# EAGLE design Bordnetzwandler (EAGLE 6.5.0)

## Sheet 1 of 3: Supply
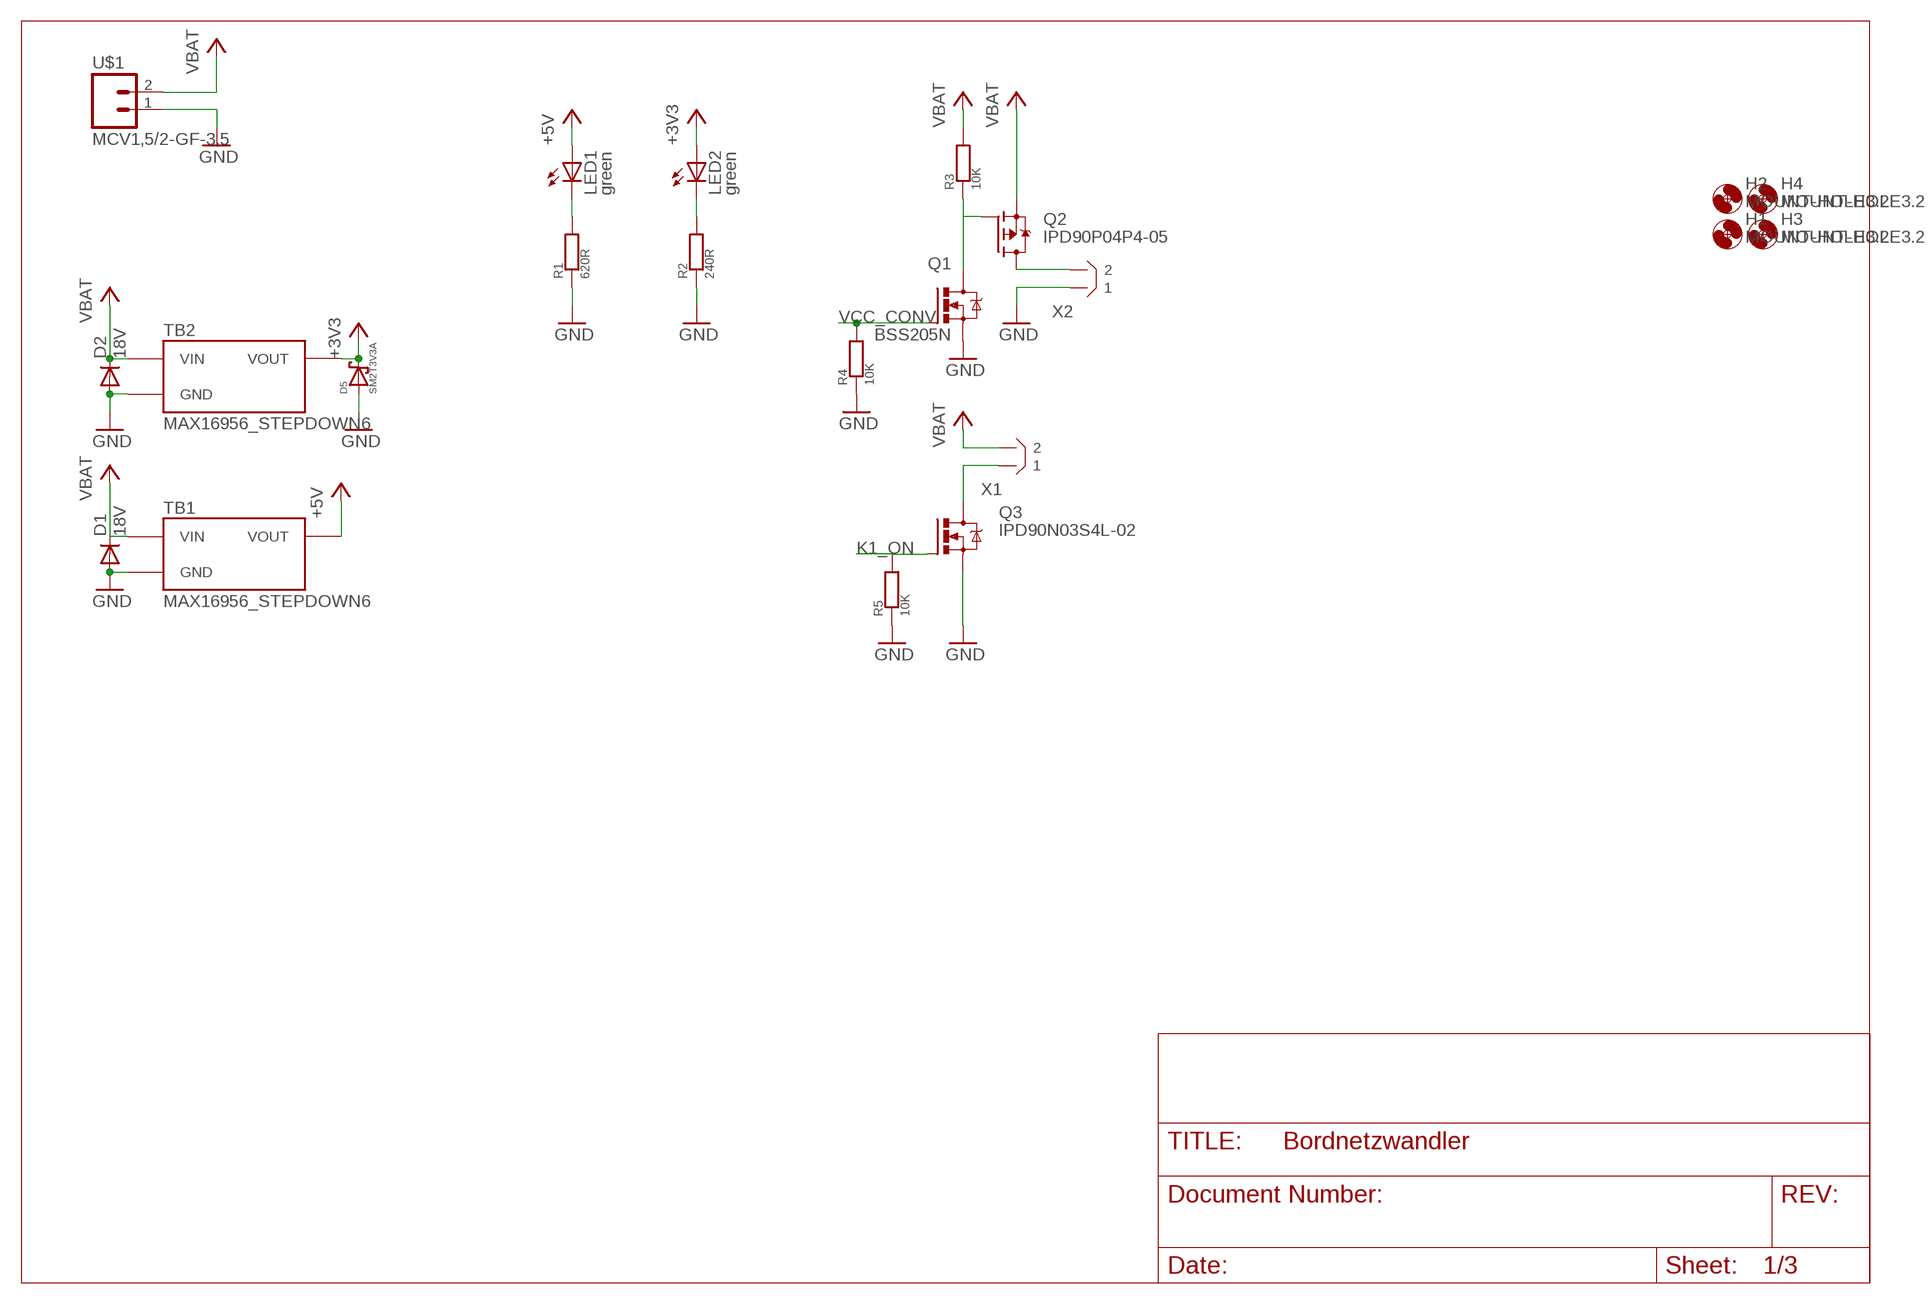
[diagram p0: schematic, sheet 1]

### Parts
D1  18V  DIODE-DO214AA  [DO214AA]
D2  18V  DIODE-DO214AA  [DO214AA]
D5  SM2T3V3A  [SM2T3V3A]
H1  MOUNT-HOLE3.2  [3,2]
H2  MOUNT-HOLE3.2  [3,2]
H3  MOUNT-HOLE3.2  [3,2]
H4  MOUNT-HOLE3.2  [3,2]
LED1  green  LEDCHIP-LED0805  [CHIP-LED0805]
LED2  green  LEDCHIP-LED0805  [CHIP-LED0805]
Q1  BSS205N  [SOT23]
Q2  IPD90P04P4-05  [TO252]
Q3  IPD90N03S4L-02  [TO252]
R1  620R  R  [R0805]
R2  240R  R  [R0805]
R3  10K  R  [R0805]
R4  10K  R  [R0805]
R5  10K  R  [R0805]
TB1  MAX16956_STEPDOWN6  [MAX16956_STEPDOWN6]
TB2  MAX16956_STEPDOWN6  [MAX16956_STEPDOWN6]
U$1  MCV1,5/2-GF-3,5  [MCV1,5/2-GF-3,5]
X1  B2B-XH  [B2B-XH]
X2  B2B-XH  [B2B-XH]

### Nets
+3V3: D5.P$2 LED2.A TB2.VOUT ; also sheet 2
+5V: LED1.A TB1.VOUT ; also sheet 2,3
GND: D1.A D2.A D5.P$1 D5.P$11 Q1.2(S) Q3.3(S) R1.1 R2.1 R4.1 R5.1 TB1.GND TB1.GND2(GND) TB2.GND TB2.GND2(GND) U$1.1 X2.P$1 ; also sheet 2,3
K1_ON: Q3.1(G) R5.2 ; also sheet 2
N$1: LED1.C R1.2
N$2: LED2.C R2.2
N$3: Q1.3(D) Q2.1(G) R3.1
N$6: Q2.2(D) X2.P$2
N$10: Q3.2(D) X1.P$1
VBAT: D1.C D2.C Q2.3(S) R3.2 TB1.VIN TB2.VIN U$1.2 X1.P$2 ; also sheet 2,3
VCC_CONV: Q1.1(G) R4.2 ; also sheet 2

## Sheet 2 of 3: Prozessor
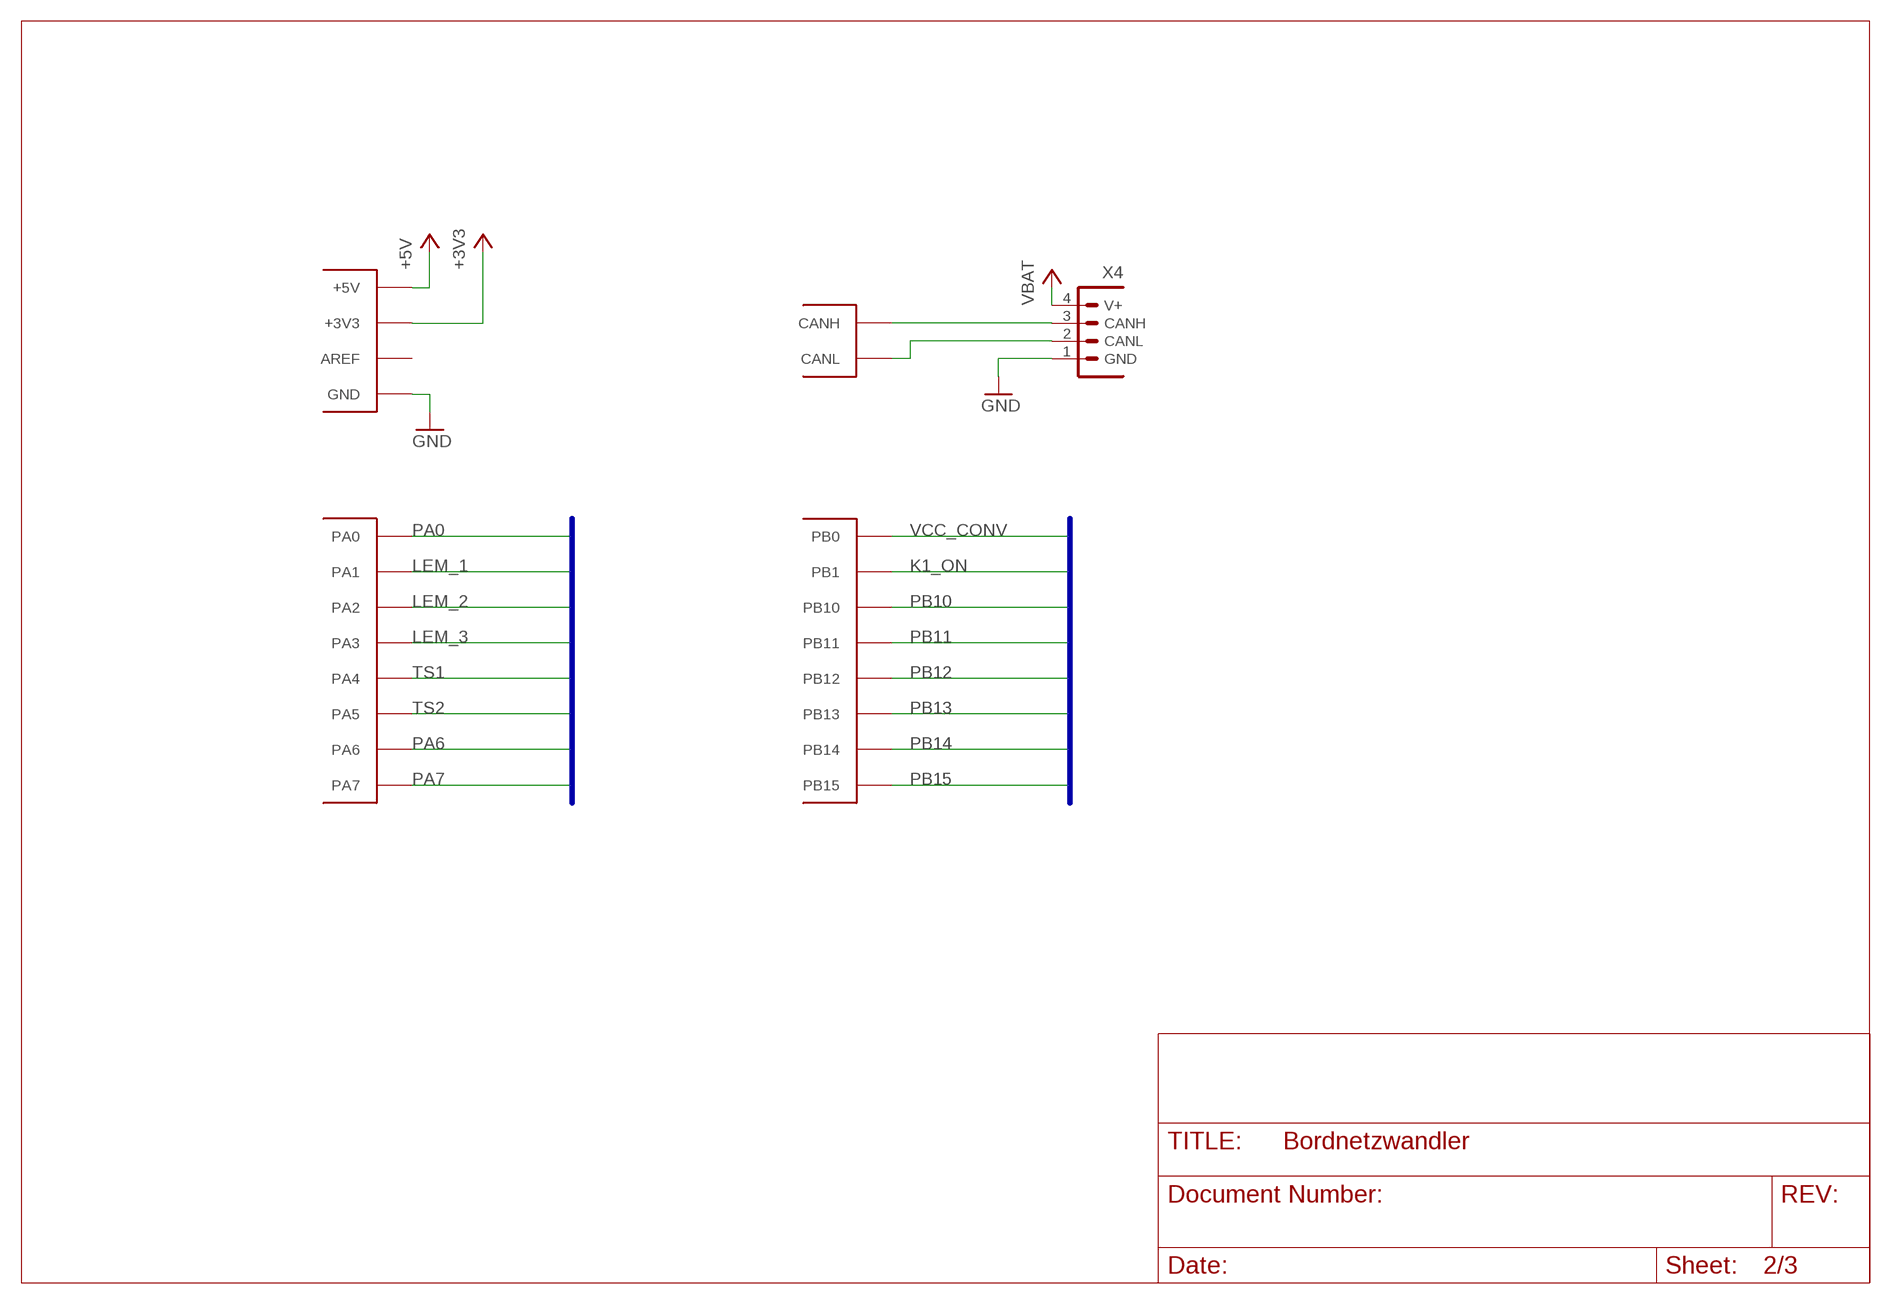
[diagram p1: schematic, sheet 2]

### Parts
CANIO_1  STM32F103XX_CAN-IO-EXPANDER  [STM32F103XX_CANIO-EXPANDER]
X4  CIOC_4-1-FV-A_CAN-BELEGUNG  [CIOC_4-1-FV]

### Nets
+3V3: CANIO_1.VCC(+3V3) ; also sheet 1
+5V: CANIO_1.+5V ; also sheet 1,3
CAN1_H: CANIO_1.CANH X4.3(CANH)
CAN1_L: CANIO_1.CANL X4.2(CANL)
GND: CANIO_1.GND1(GND) X4.1(GND) ; also sheet 1,3
K1_ON: CANIO_1.PB1 ; also sheet 1
LEM_1: CANIO_1.PA1 ; also sheet 3
LEM_2: CANIO_1.PA2 ; also sheet 3
LEM_3: CANIO_1.PA3 ; also sheet 3
PA0: CANIO_1.PA0
PA6: CANIO_1.PA6
PA7: CANIO_1.PA7
PB10: CANIO_1.PB10
PB11: CANIO_1.PB11
PB12: CANIO_1.PB12
PB13: CANIO_1.PB13
PB14: CANIO_1.PB14
PB15: CANIO_1.PB15
TS1: CANIO_1.PA4 ; also sheet 3
TS2: CANIO_1.PA5 ; also sheet 3
VBAT: X4.4(V+) ; also sheet 1,3
VCC_CONV: CANIO_1.PB0 ; also sheet 1
Unconnected: CANIO_1.AREF

### Buses
PA[0..7]
PB[10..15],PB[0..1]

## Sheet 3 of 3: IO
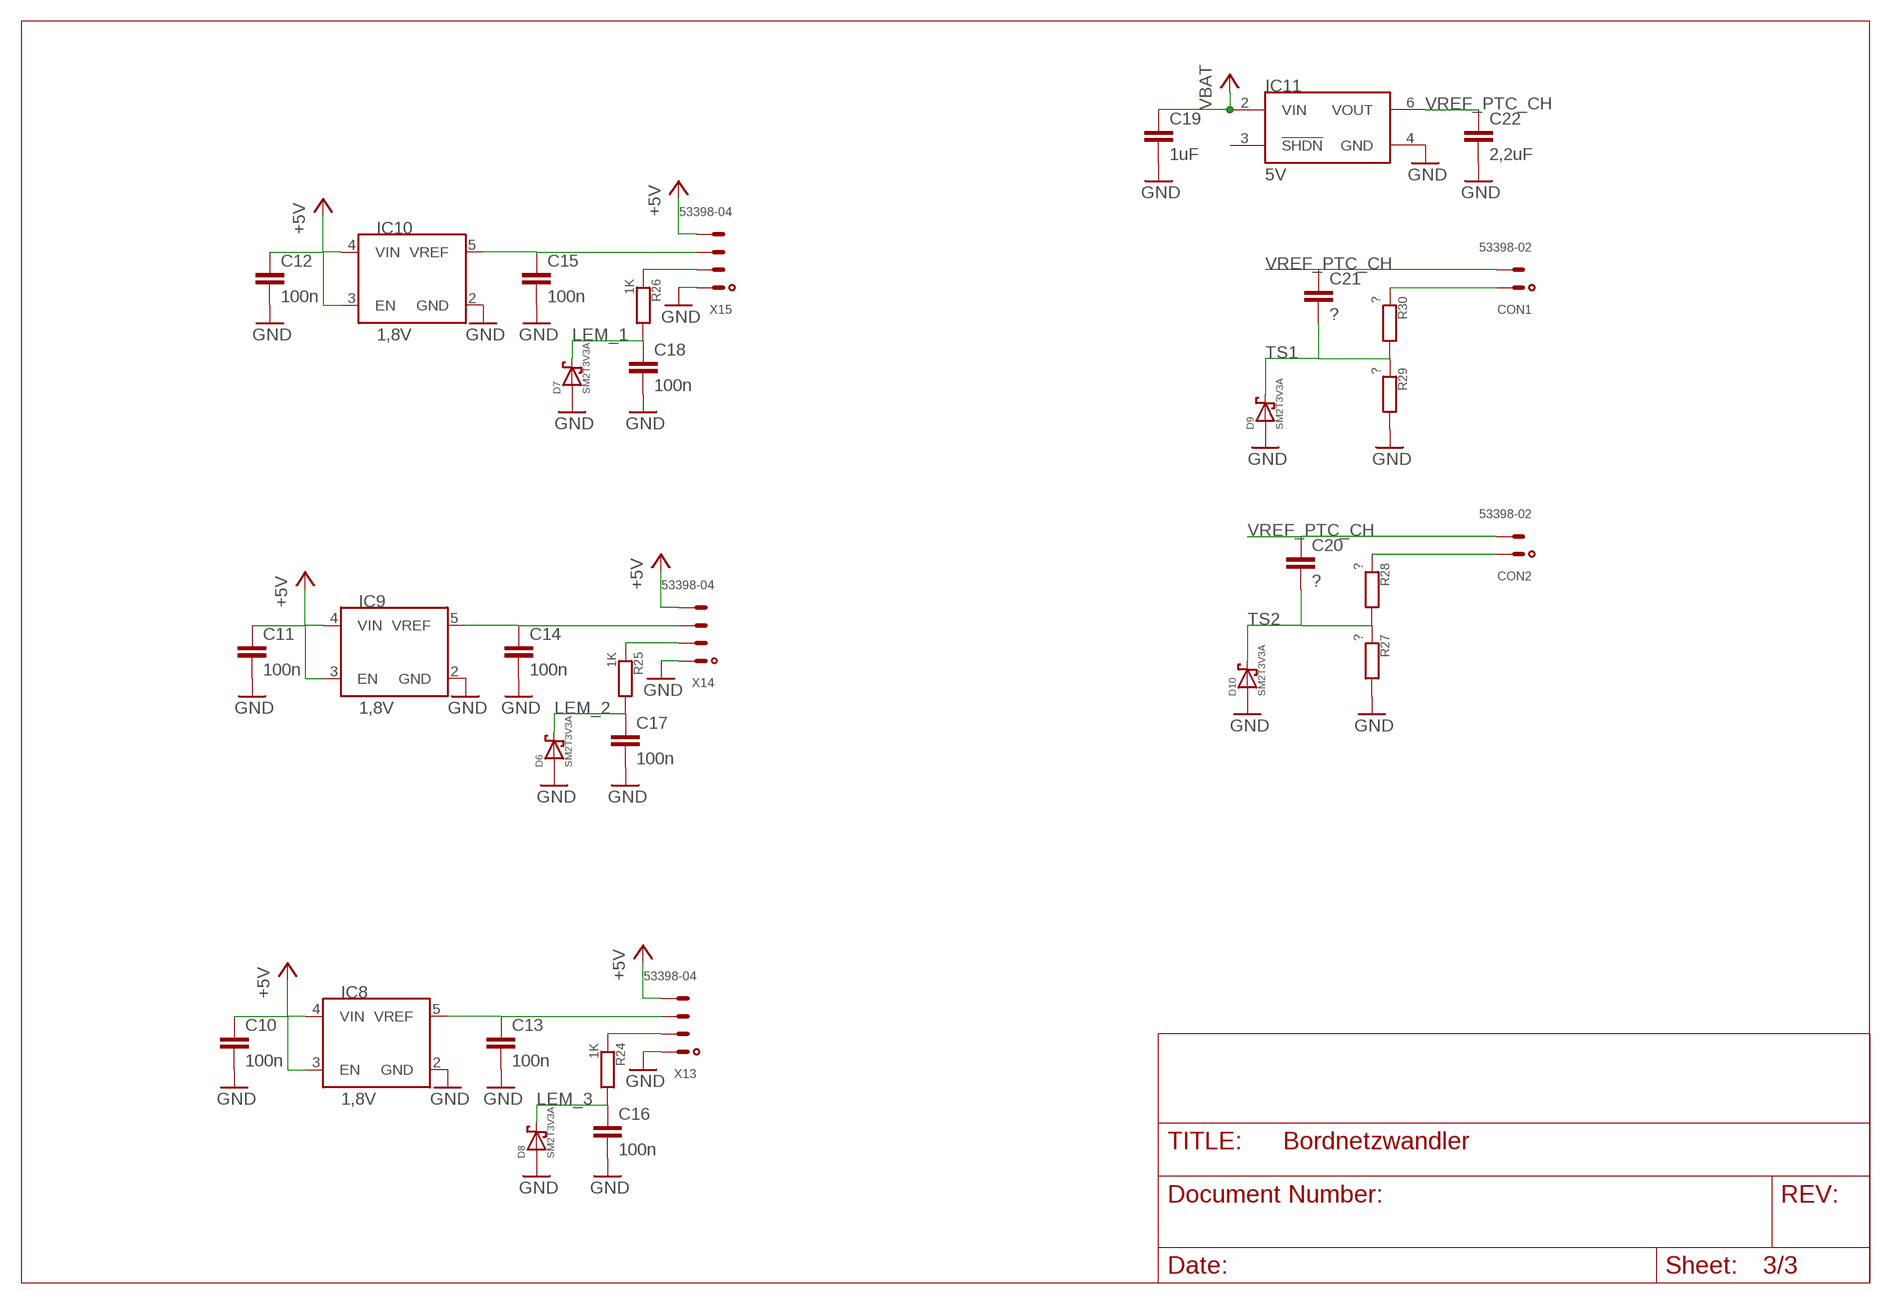
[diagram p2: schematic, sheet 3]

### Parts
C10  100n  C-EUC0805  [C0805]
C11  100n  C-EUC0805  [C0805]
C12  100n  C-EUC0805  [C0805]
C13  100n  C-EUC0805  [C0805]
C14  100n  C-EUC0805  [C0805]
C15  100n  C-EUC0805  [C0805]
C16  100n  C-EUC0805  [C0805]
C17  100n  C-EUC0805  [C0805]
C18  100n  C-EUC0805  [C0805]
C19  1uF  C-EUC0805  [C0805]
C20  ?  C-EUC0805  [C0805]
C21  ?  C-EUC0805  [C0805]
C22  2,2uF  C-EUC0805  [C0805]
CON1  53398-02  [53398-02]
CON2  53398-02  [53398-02]
D6  SM2T3V3A  [SM2T3V3A]
D7  SM2T3V3A  [SM2T3V3A]
D8  SM2T3V3A  [SM2T3V3A]
D9  SM2T3V3A  [SM2T3V3A]
D10  SM2T3V3A  [SM2T3V3A]
IC8  1,8V  LM4132L  [SOT23-5L]
IC9  1,8V  LM4132L  [SOT23-5L]
IC10  1,8V  LM4132L  [SOT23-5L]
IC11  5V  LT1461  [SO08]
R24  1K  R  [R0805]
R25  1K  R  [R0805]
R26  1K  R  [R0805]
R27  ?  R  [R0805]
R28  ?  R  [R0805]
R29  ?  R  [R0805]
R30  ?  R  [R0805]
X13  53398-04  [53398-04]
X14  53398-04  [53398-04]
X15  53398-04  [53398-04]

### Nets
+5V: C10.1 C11.1 C12.1 IC8.3(EN) IC8.4(VIN) IC9.3(EN) IC9.4(VIN) IC10.3(EN) IC10.4(VIN) X13.4 X14.4 X15.4 ; also sheet 1,2
GND: C10.2 C11.2 C12.2 C13.2 C14.2 C15.2 C16.2 C17.2 C18.2 C19.2 C22.2 D6.P$1 D6.P$11 D7.P$1 D7.P$11 D8.P$1 D8.P$11 D9.P$1 D9.P$11 D10.P$1 D10.P$11 IC8.2(GND) IC9.2(GND) IC10.2(GND) IC11.4(GND) R27.2 R29.2 X13.1 X14.1 X15.1 ; also sheet 1,2
LEM_1: C18.1 D7.P$2 R26.2 ; also sheet 2
LEM_2: C17.1 D6.P$2 R25.2 ; also sheet 2
LEM_3: C16.1 D8.P$2 R24.2 ; also sheet 2
N$4: C13.1 IC8.5(VREF) X13.3
N$7: R26.1 X15.2
N$9: C14.1 IC9.5(VREF) X14.3
N$25: CON1.1 R30.1
N$31: R25.1 X14.2
N$32: C15.1 IC10.5(VREF) X15.3
N$33: R24.1 X13.2
N$35: CON2.1 R28.1
TS1: C21.2 D9.P$2 R29.1 R30.2 ; also sheet 2
TS2: C20.2 D10.P$2 R27.1 R28.2 ; also sheet 2
VBAT: C19.1 IC11.2(VIN) ; also sheet 1,2
VREF_PTC_CH: C20.1 C21.1 C22.1 CON1.2 CON2.2 IC11.6(VOUT)
Unconnected: IC11.3(!SHDN)

## Library data of the parts
C10-C22 = rcl:C-EU: CAPACITOR, European symbol
CANIO_1 = tera-boards:STM32F103XX_CAN-IO-EXPANDER: Tera CAN-IO Expander Board
CON1 CON2 = con-molex:53?-02: CONNECTOR wire to board 1.25 mm (.049 inch) pitch header
D1 D2 = diode:DIODE-: DIODE
D5-D10 = st:SM2T3V3A: ST2T3V3A Low voltage TransilTM
H1-H4 = holes:MOUNT-HOLE: MOUNTING HOLE with drill center marker
IC8-IC10 = ti:LM4132
IC11 = linear:LT1461
LED1 LED2 = led:LED: LED OSRAM: - CHIPLED LG R971, LG N971, LY N971, LG Q971, LY Q971, LO R971, LY R971 LH N974, LH R974 LS Q976, LO Q976, LY Q976 LO Q996 - Hyper CHIPLED LW Q18S LB Q993, LB Q99A, LB R99A - SideLED LS A670, LO A670, LY A670, LG A670, LP A670 LB A673, LV A673, LT A673, LW A673 LH A674 LY A675 LS A676, LA A676, LO A676, LY A676, LW A676 LS A679, LY A679, LG A679 - Hyper Micro SIDELED® LS Y876, LA Y876, LO Y876, LY Y876 LT Y87S - SmartLED LW L88C, LW L88S LB L89C, LB L89S, LG L890 LS L89K, LO L89K, LY L89K LS L896, LA L896, LO L896, LY L896 - TOPLED LS T670, LO T670, LY T670, LG T670, LP T670 LSG T670, LSP T670, LSY T670, LOP T670, LYG T670 LG T671, LOG T671, LSG T671 LB T673, LV T673, LT T673, LW T673 LH T674 LS T676, LA T676, LO T676, LY T676, LB T676, LH T676, LSB T676, LW T676 LB T67C, LV T67C, LT T67C, LS T67K, LO T67K, LY T67K, LW E67C LS E67B, LA E67B, LO E67B, LY E67B, LB E67C, LV E67C, LT E67C LW T67C LS T679, LY T679, LG T679 LS T770, LO T770, LY T770, LG T770, LP T770 LB T773, LV T773, LT T773, LW T773 LH T774 LS E675, LA E675, LY E675, LS T675 LS T776, LA T776, LO T776, LY T776, LB T776 LHGB T686 LT T68C, LB T68C - Hyper Mini TOPLED® LB M676 - Mini TOPLED Santana® LG M470 LS M47K, LO M47K, LY M47K Source: http://www.osram.convergy.de LUXEON: - LUMILED® LXK2-PW12-R00, LXK2-PW12-S00, LXK2-PW14-U00, LXK2-PW14-V00 LXK2-PM12-R00, LXK2-PM12-S00, LXK2-PM14-U00 LXK2-PE12-Q00, LXK2-PE12-R00, LXK2-PE12-S00, LXK2-PE14-T00, LXK2-PE14-U00 LXK2-PB12-K00, LXK2-PB12-L00, LXK2-PB12-M00, LXK2-PB14-N00, LXK2-PB14-P00, LXK2-PB14-Q00 LXK2-PR12-L00, LXK2-PR12-M00, LXK2-PR14-Q00, LXK2-PR14-R00 LXK2-PD12-Q00, LXK2-PD12-R00, LXK2-PD12-S00 LXK2-PH12-R00, LXK2-PH12-S00 LXK2-PL12-P00, LXK2-PL12-Q00, LXK2-PL12-R00 Source: www.luxeon.com KINGBRIGHT: KA-3528ASYC Source: www.kingbright.com
Q1 = infineon:BSS205N: Infineon Small Signal Transistor, OptiMOS 2 Technology, 20V, 2.5A SOT23
Q2 = infineon:IPD90P04P4-05: Infineon P-Channel Mosfet for automotive puproses. IDmax=-90A V_DSmax=-40V
Q3 = infineon:IPD90N03S4L-02: Automotive Power Mosfet with CMOS Logic Level an very low Ron
R1-R5 R24-R30 = useful:R
TB1 TB2 = tera-boards:MAX16956_STEPDOWN6
U$1 = con-phoenix:MCV1,5/2-GF-3,5
X1 X2 = con-jst-xh:?2B-XH
X4 = con-phoenix:CIOC_4-1-FV-A_CAN-BELEGUNG: CIOC_4-1-FV-A mit Bezeichnungen für CAN-Signale und Versorgungen; MANUF: Phoenix-Contact; ORDERNR: 1701388
X13-X15 = con-molex:53?-04: CONNECTOR wire to board 1.25 mm (.049 inch) pitch header

## Board
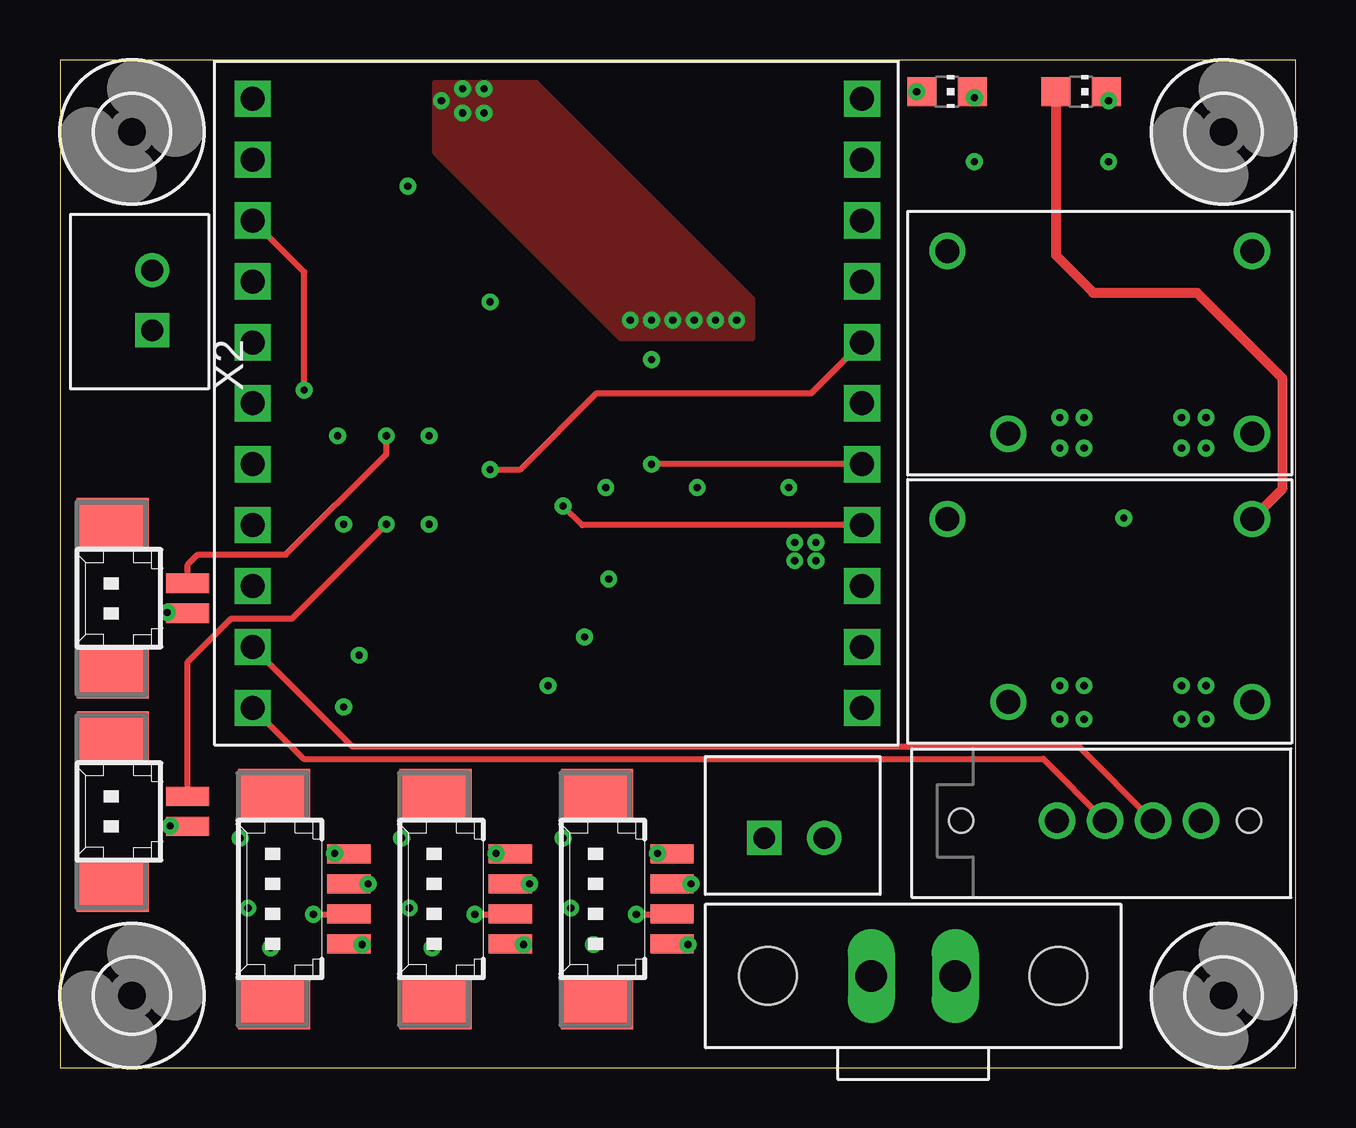
[diagram p3: board, top side]
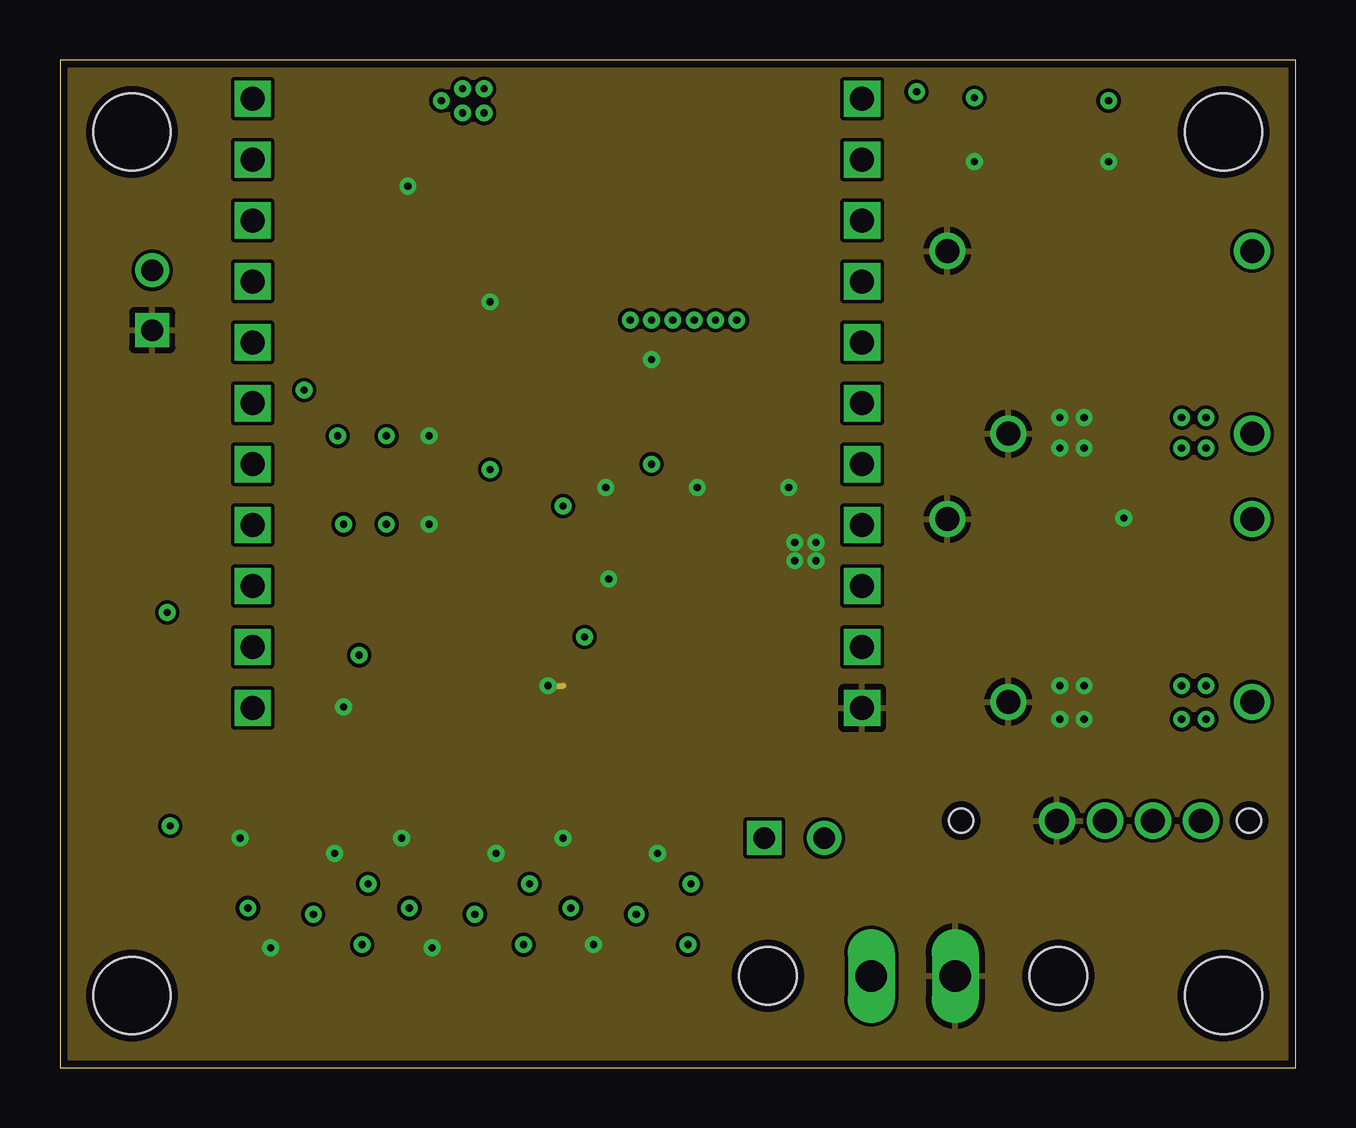
[diagram p4: board, inner layer Route2]
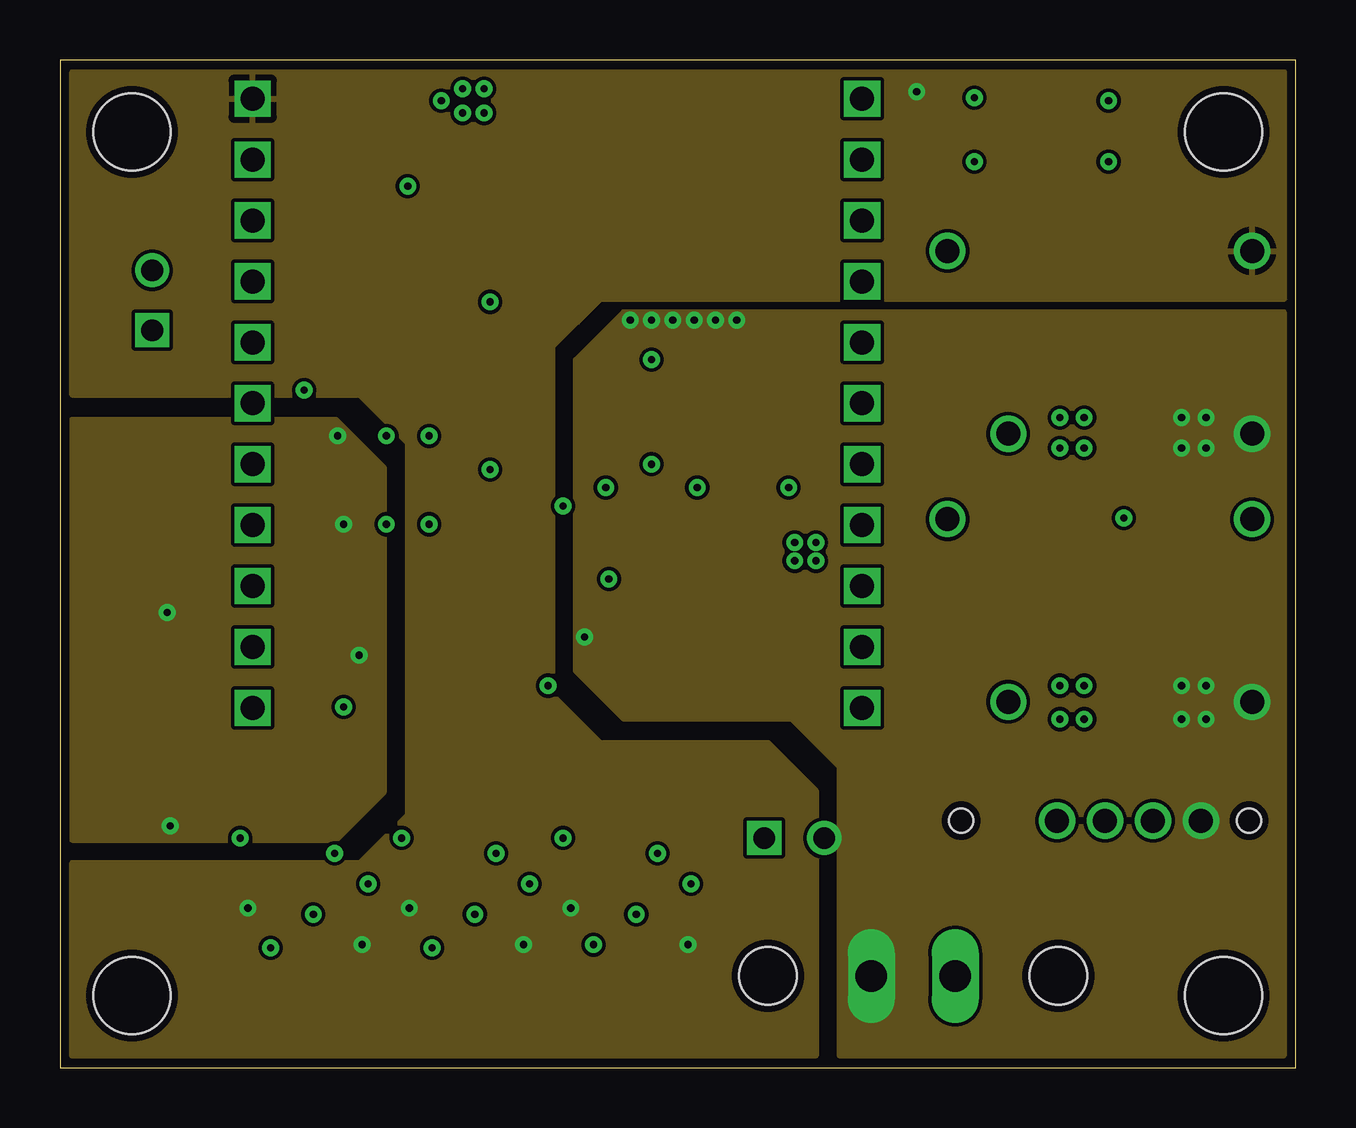
[diagram p5: board, inner layer Route15]
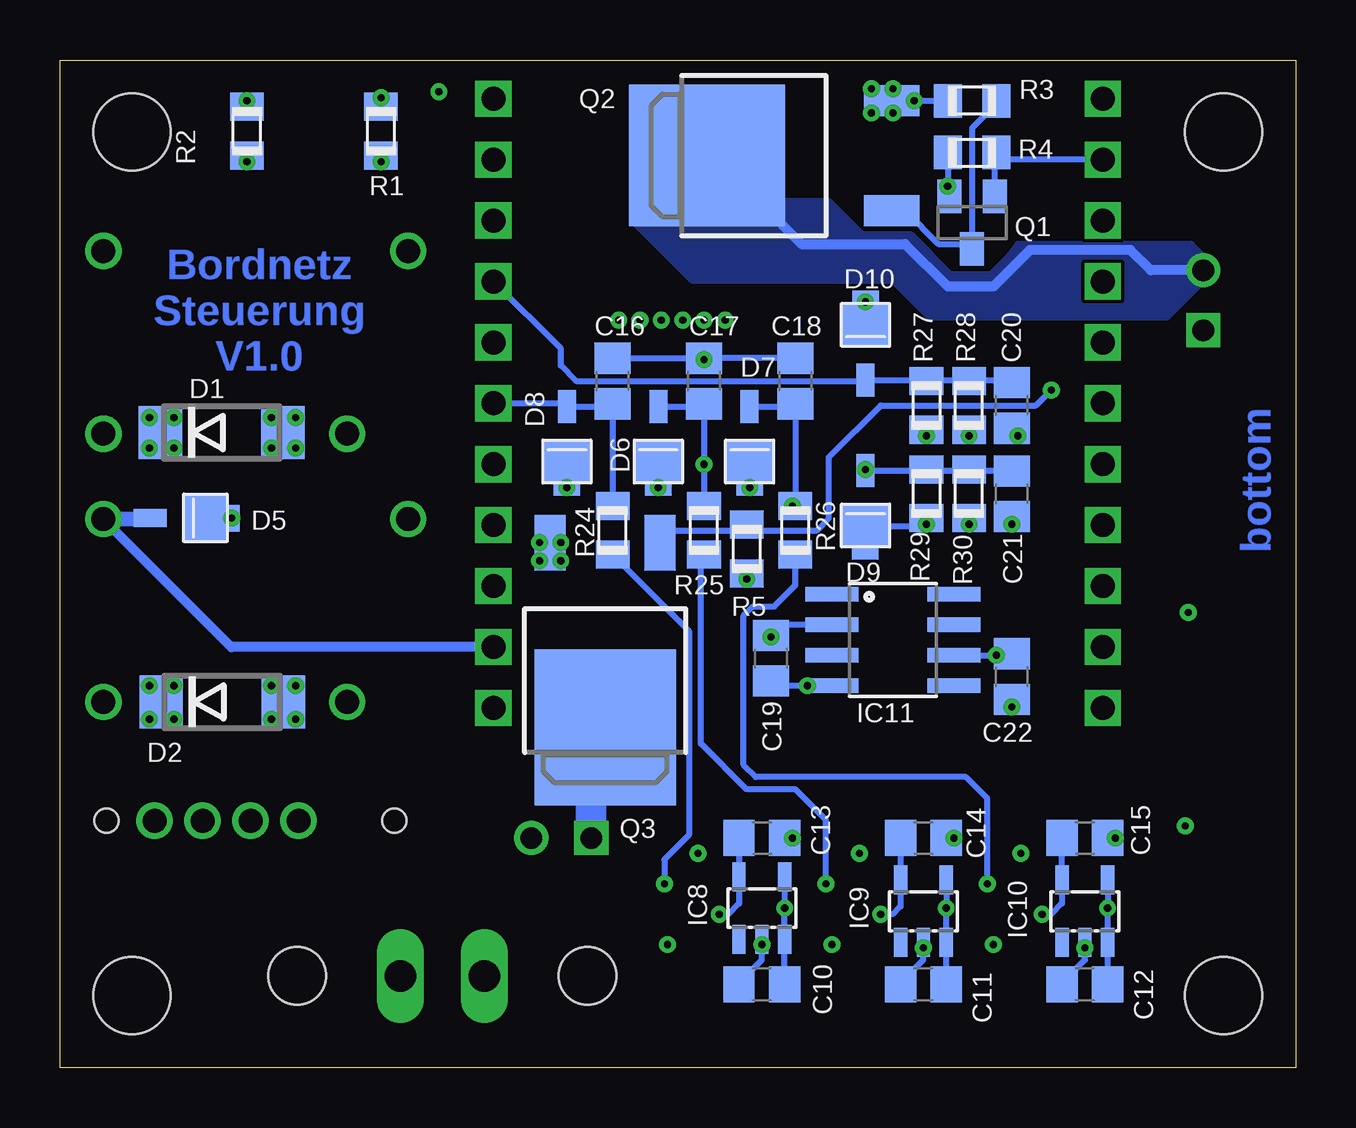
[diagram p6: board, bottom side, seen from below]

Size 51.5 x 42 mm. Coordinates in mm from the lower left corner, seen from the top.
Outline: 0,0 51.5,0 51.5,42 0,42 0,0
Copper layers (1+2*15+16): Top 0.035mm / dielectric 0.2mm / Route2 0.035mm / dielectric 0.5mm / Route15 0.035mm / dielectric 0.2mm / Bottom 0.035mm
Design rules "ats_35u_4layer *": minimum track width 6mil, minimum drill 0.2mm, track to track 6mil, track to pad 6mil, pad to pad 6mil, via to via 6mil, smd to smd 6mil, copper to edge 0.3mm, drill to drill 8mil, minimum pad ring 10mil, minimum via ring 0.2mm, stop-mask expansion 4mil, vias tented up to drill 0mil, thermal gap 10mil

### Footprints (pad centres in the part's own frame; a part is rotated, then mirrored left to right if it is on the bottom)
C0805 = smd 1.3 x 1.5: 1 -0.95,0; 2 0.95,0
STM32F103XX_CANIO-EXPANDER = drill 1 square: +5V 0,0; AREF 25.4,0; CANH 0,-22.86; CANL 0,-25.4; GND1 25.4,-25.4; PA0 25.4,-20.32; PA1 25.4,-17.78; PA2 25.4,-15.24; PA3 25.4,-12.7; PA4 25.4,-10.16; PA5 25.4,-7.62; PA6 25.4,-5.08; PA7 25.4,-2.54; PB0 0,-2.54; PB1 0,-5.08; PB10 0,-7.62; PB11 0,-10.16; PB12 0,-12.7; PB13 0,-15.24; PB14 0,-17.78; PB15 0,-20.32; VCC 25.4,-22.86
53398-02 = smd 0.8 x 1.8: 1 0.625,-2.5; 2 -0.625,-2.5 | smd 2.1 x 3: S1 3.125,0.625; S2 -3.125,0.625
DO214AA = smd 1.8 x 2.2: A 2.55,0; C -2.55,0
SM2T3V3A = smd 1.82 x 2.03: P$1 -1.21,0 | smd 1.38 x 0.75: P$2 1.1,0 | smd 0.5 x 1.1: P$11 -2.37,0.005
3,2 = hole 3.2: 0,0
SOT23-5L = smd 0.55 x 1.2: 1 -0.95,-1.3; 2 0,-1.3; 3 0.95,-1.3; 4 0.95,1.3; 5 -0.95,1.3
SO08 = smd 0.61 x 2.21: 1 -1.905,-2.54; 2 -0.635,-2.54; 3 0.635,-2.54; 4 1.905,-2.54; 5 1.905,2.54; 6 0.635,2.54; 7 -0.635,2.54; 8 -1.905,2.54
CHIP-LED0805 = smd 1.2 x 1.2: A 0,-1.05; C 0,1.05
SOT23 = smd 1 x 1.4: 1 -0.95,-1.1; 2 0.95,-1.1; 3 0,1.1
TO252 = smd 1.3 x 2.3: 1 -2.29,-4.9; 3 2.29,-4.9 | smd 5.9 x 6.5: 2 0,2.8
R0805 = smd 1.168 x 1.397: 1 -1.016,0; 2 1.016,0
MAX16956_STEPDOWN6 = drill 1: GND 14.351,1.651; GND2 11.811,9.271; VIN 1.651,9.271; VOUT 1.651,1.651
MCV1,5/2-GF-3,5 = drill 1.3 long: 1 0,3.5; 2 0,0 | hole 2.4: 0,7.8; 0,-4.3
B2B-XH = drill 0.9 pad 1.422 square: P$1 0,0 | drill 0.9 pad 1.422: P$2 2.5,0
CIOC_4-1-FV = drill 1: 1 0,0; 2 2,0; 3 4,0; 4 6,0 | hole 1: 8,0; -4,0
53398-04 = smd 0.8 x 1.8: 1 1.875,-2.5; 2 0.625,-2.5; 3 -0.625,-2.5; 4 -1.875,-2.5 | smd 2.1 x 3: S1 4.375,0.625; S2 -4.375,0.625

### Placement (x,y rotation side)
C10  22.24,3.47 180 bottom
C11  15.51,3.47 180 bottom
C12  8.78,3.47 180 bottom
C13  22.24,9.57 0 bottom
C14  15.51,9.57 0 bottom
C15  8.78,9.57 0 bottom
C16  28.47,28.62 90 bottom
C17  24.66,28.62 90 bottom
C18  20.85,28.62 90 bottom
C19  21.86,17.06 270 bottom
C20  11.83,27.6 90 bottom
C21  11.83,23.92 90 bottom
C22  11.83,16.3 270 bottom
CANIO_1  8.03,40.39 0 top
CON1  2.83,10.67 90 top
CON2  2.83,19.56 90 top
D1  44.76,26.47 0 bottom
D2  44.74,15.24 0 bottom
D5  46.63,22.91 180 bottom
D6  26.56,26.46 90 bottom
D7  22.75,26.46 90 bottom
D8  30.37,26.46 90 bottom
D9  17.93,23.79 90 bottom
D10  17.93,29.76 270 bottom
H1  48.5,3 0 top
H2  3,3 0 top
H3  48.5,39 0 top
H4  3,39 0 top
IC8  22.24,6.65 0 bottom
IC9  15.51,6.52 0 bottom
IC10  8.78,6.52 0 bottom
IC11  16.78,17.82 270 bottom
LED1  36.98,40.68 270 top
LED2  42.56,40.68 270 top
Q1  13.48,35.22 180 bottom
Q2  21.73,38.01 90 bottom
Q3  28.78,16.97 180 bottom
R1  38.12,39.03 90 bottom
R2  43.71,39.03 90 bottom
R3  13.48,40.3 180 bottom
R4  13.48,38.14 0 bottom
R5  22.87,21.62 90 bottom
R24  28.47,22.39 90 bottom
R25  24.66,22.39 90 bottom
R26  20.85,22.39 90 bottom
R27  15.39,27.6 270 bottom
R28  13.61,27.6 90 bottom
R29  15.39,23.92 270 bottom
R30  13.61,23.92 90 bottom
TB1  51.34,35.69 180 top
TB2  51.34,24.51 180 top
U$1  33.81,3.81 270 top
X1  29.36,9.57 0 top
X2  3.84,30.74 90 top
X4  41.56,10.29 0 top
X13  23,7.03 90 top
X14  16.27,7.03 90 top
X15  9.54,7.03 90 top

### Tracks (layer width: path | path; a pad name or v marks a point on that pad's centre or on a via)
+3V3
  Top 0.406: LED2.A 41.51,33.86 43.07,32.3 47.39,32.3 50.95,28.74 50.95,24.12 TB2.VOUT
  Bottom 0.406: CANIO_1.VCC 44.36,17.53 TB2.VOUT
  Bottom 0.61: TB2.VOUT 47.82,22.86 D5.P$2
+5V  (via drill 0.3)
  Top 0.254: X15.4 12.43,5.15 v12.59,5.12 | X14.4 19.29,5.15 v19.32,5.12 | X13.4 25.83,5.15 v26.18,5.12 | LED1.A 35.92,40.71 35.83,40.68 v35.7,40.68
  Bottom 0.254: C12.1 IC10.3 v7.83,6.65 IC10.4 | C11.1 IC9.3 v14.56,6.65 IC9.4 | C10.1 IC8.3 v21.29,6.65 IC8.4
  pour Route15: 31.5,0.5 0.5,0.5 0.52,8.54 12.52,8.54 14.52,10.54 14.52,26.04 12.52,28.04 0.52,28.04 0.52,41.5 51.02,41.5 51.02,32.04 22.52,32.04 20.52,30.04 20.52,15.54 22.52,13.54 29.5,13.54 31.5,11.54
CAN1_H
  Top 0.254: CANIO_1.CANH 12.19,13.38 42.48,13.38 X4.3
CAN1_L
  Top 0.254: CANIO_1.CANL 10.16,12.87 40.98,12.87 X4.2
GND  (via drill 0.3)
  Top 0.254: X15.1 11.66,8.89 v11.45,8.93 | X14.1 19.28,8.89 v18.18,8.93 | X13.1 25.38,8.97 v24.91,8.93
  Route2 0.254: v20.34,15.92 20.97,15.92 | v11.83,15.03 11.83,14.9
  Bottom 0.254: D7.P$1 22.75,24.22 D7.P$11 v22.76,24.18 v22.75,24.17 | v26.56,24.17 v26.57,24.18 D6.P$11 26.56,24.22 D6.P$1 | D8.P$1 30.37,24.22 D8.P$11 v30.38,24.18 v30.37,24.17 | C16.2 C17.2 | C17.2 v24.66,29.5 | C18.2 C17.2 | C19.2 21.67,15.92 v20.34,15.92 IC11.4 | C22.2 v11.83,15.03 | R27.2 v15.39,26.33 | R29.2 v15.39,22.65 15.45,22.58 D9.P$1 D9.P$11 | R4.1 v14.5,36.74 14.5,36.39 Q1.2 | v17.93,31.92 17.92,32.04 D10.P$11 v17.93,31.92 | D10.P$1 v17.93,31.92 | C15.2 v7.51,9.57 | C14.2 v14.24,9.57 | C13.2 v20.97,9.57 | C12.2 9.73,3.54 8.78,4.49 v8.78,4.99 | IC10.2 v8.78,4.99 | 8.78,4.61 v8.78,4.99 | C11.2 16.4,3.47 16.4,3.6 15.51,4.49 v15.51,4.99 IC9.2 | IC8.2 v22.24,5.12 22.24,4.49 23.19,3.54 C10.2 | D5.P$1 D5.P$11 v44.34,22.9 | D1.A 42.21,26.61 v42.69,27.09 | D2.A 42.19,15.41 v42.69,15.92 | R2.1 v43.71,37.76 | R1.1 v38.12,37.76 | R5.1 v22.88,20.36 | Q3.3 31.01,21.81 v30.62,21.12
  other vias: 41.67,27.09 41.67,25.82 42.69,25.82 41.67,15.92 42.69,14.52 41.67,14.52 30.62,21.89 31.51,21.89 31.51,21.12
  pour Route2: -5.38,-3.98 -3.22,44.5 55.74,45.65 53.33,-2.97
K1_ON  (via drill 0.3)
  Top 0.254: v10.18,28.23 10.18,33.16 CANIO_1.PB1
  Bottom 0.254: Q3.1 26.18,22.18 26.18,22.27 26.31,22.39 23.39,22.39 23.15,22.63 R5.2 22.61,22.63 22.37,22.39 19.96,22.39 19.45,22.9 19.45,25.44 17.29,27.6 10.81,27.6 v10.18,28.23
LEM_1  (via drill 0.3)
  Top 0.254: CANIO_1.PA1 21.77,22.61 v20.97,23.41
  Bottom 0.254: 20.85,27.68 C18.1 | C18.1 R26.2 v20.97,23.41 | D7.P$2 20.96,27.56 C18.1
LEM_2  (via drill 0.3)
  Top 0.254: CANIO_1.PA2 v24.66,25.15
  Bottom 0.254: 24.66,27.68 C17.1 | C17.1 v24.66,25.15 R25.2 | D6.P$2 24.77,27.56 C17.1
LEM_3
  Bottom 0.254: 28.47,27.68 C16.1 | CANIO_1.PA3 30.37,27.69 D8.P$2 28.57,27.56 C16.1 | C16.1 R24.2
N$1  (via drill 0.3)
  Top 0.254: LED1.C v38.12,40.43
  Bottom 0.254: v38.12,40.43 R1.2
N$2  (via drill 0.3)
  Top 0.254: LED2.C v43.71,40.3
  Bottom 0.254: v43.71,40.3 R2.2
N$3
  Bottom 0.254: Q2.1 16.27,35.72 14.88,34.33 13.69,34.33 Q1.3 13.48,39.16 12.46,40.17 R3.1
N$4  (via drill 0.3)
  Top 0.254: v24.02,6.39 25.5,6.39 X13.3
  Bottom 0.254: C13.1 IC8.5 23.19,6.84 23.64,6.39 v24.02,6.39
N$6
  Bottom 0.406: X2.P$2 6.04,33.24 6.88,34.08 11.07,34.08 12.59,32.55 14.5,32.55 16.27,34.33 20.59,34.33 22.24,35.98 22.5,35.98 Q2.2
  pour Bottom (no thermals): 3.83,33.82 4.34,34.33 11.58,34.33 11.96,33.82 12.72,33.06 14.37,33.06 16.02,34.71 18.05,34.71 19.45,36.11 25.29,36.11 27.58,35.22 25.16,32.81 16.78,32.81 15.26,31.28 5.35,31.28 3.83,32.81
N$7  (via drill 0.3)
  Top 0.254: X15.2 12.58,7.65 v12.85,7.66
  Bottom 0.254: v12.85,7.66 12.85,11.22 13.73,12.11 22.5,12.11 23,12.61 23,18.84 22.62,19.22 21.73,19.22 20.85,20.11 R26.1
N$9  (via drill 0.3)
  Top 0.254: v17.29,6.39 18.76,6.39 X14.3
  Bottom 0.254: C14.1 IC9.5 16.46,6.71 16.78,6.39 v17.29,6.39
N$10
  Bottom 0.61: 29.36,13.12 28.78,13.7 Q3.2
  Bottom 1.27: X1.P$1 29.36,13.12
N$25  (via drill 0.3)
  Top 0.254: CON1.1 5.33,16.91 7.13,18.71 9.67,18.71 v13.61,22.65
  Bottom 0.254: v13.61,22.65 R30.1
N$31  (via drill 0.3)
  Top 0.254: X14.2 19.57,7.65 v19.58,7.66
  Bottom 0.254: v19.58,7.66 19.58,10.33 20.85,11.6 22.88,11.6 24.78,13.5 24.78,21.25 R25.1
N$32  (via drill 0.3)
  Top 0.254: v10.56,6.39 12.03,6.39 X15.3
  Bottom 0.254: C15.1 IC10.5 9.73,6.84 10.18,6.39 v10.56,6.39
N$33  (via drill 0.3)
  Top 0.254: X13.2 v26.3,7.65 v26.31,7.66
  Bottom 0.254: R24.1 25.29,18.2 25.29,9.69 26.31,8.68 v26.31,7.66
N$35  (via drill 0.3)
  Top 0.254: CON2.1 5.33,20.97 5.73,21.38 9.42,21.38 13.61,25.57 v13.61,26.33
  Bottom 0.254: v13.61,26.33 R28.1
TS1  (via drill 0.3)
  Top 0.254: v17.93,24.93 19.2,24.93 22.37,28.11 31.31,28.11 CANIO_1.PA4
  Bottom 0.254: 15.26,24.89 D9.P$2 18.01,24.89 18.05,24.93 v17.93,24.93 | 15.26,24.89 13.61,24.89 | 13.61,24.89 11.85,24.89 C21.2 | R29.1 15.3,24.93 15.26,24.89 | R30.2 13.61,24.89
TS2
  Bottom 0.254: 15.26,28.66 D10.P$2 17.97,28.62 29.99,28.62 30.62,29.25 30.62,29.96 CANIO_1.PA5 | 15.26,28.66 13.61,28.66 | 13.61,28.66 11.94,28.66 C20.2 | R27.1 15.3,28.62 15.26,28.66 | R28.2 13.61,28.66
VBAT  (via drill 0.3)
  Bottom 0.254: Q2.3 14.63,40.3 R3.2 | IC11.2 21.41,18.46 21.83,18.04 | D1.C 47.31,26.63 v47.77,27.09 | D2.C 47.29,15.43 v47.77,15.92
  Bottom 0.406: v21.86,17.95 21.93,18.01 C19.1 21.83,18.04 | Q2.3 16.78,40.25 v15.89,40.3
  other vias: 46.75,27.09 46.75,25.82 47.77,25.82 46.75,15.92 46.75,14.52 47.77,14.52 17.67,40.81 17.67,39.79 16.78,39.79 16.78,40.81 23.77,31.16 24.66,31.16 25.55,31.16 26.43,31.16 27.32,31.16 28.21,31.16
  pour Route15 (no thermals): 51,31.5 51,0.5 32.5,0.5 32.52,12.54 30.52,14.54 23.5,14.54 21.5,16.54 21.5,29.5 23.5,31.5
  pour Top (no thermals): 15.64,41.06 19.83,41.06 28.85,32.04 28.85,30.39 23.39,30.39 15.64,38.14
VCC_CONV
  Bottom 0.254: Q1.1 12.53,38.07 R4.2 12.17,37.85 CANIO_1.PB0
VREF_PTC_CH  (via drill 0.3)
  Top 0.254: CON2.2 4.75,18.94 4.72,18.96 v4.46,18.96 | CON1.2 4.62,10.05 v4.59,10.07
  Bottom 0.254: IC11.6 v12.46,17.19 | v12.46,17.19 11.89,17.19 C22.1 12.15,17.25 v12.46,17.19 | C20.1 11.64,26.65 11.19,26.2 v11.58,26.33 | C21.1 v11.83,22.65
  pour Route15: 0.5,27 0.5,9.5 11.5,9.5 13.5,11.5 13.5,25 11.5,27

### Text on the board
Bottom: Bordnetz / Steuerung / V1.0 | bottom
tTest: Bordnetz / Steuerung | 3V3 / OK | 5V / OK | TERA TU Graz, / April 2014 / Pöschl | 5V | Wandler | TS2 | 3V3 | LEM 1 | LEM 2 | LEM 3 | TS1 | GND / V_OUT / VREF / 5V